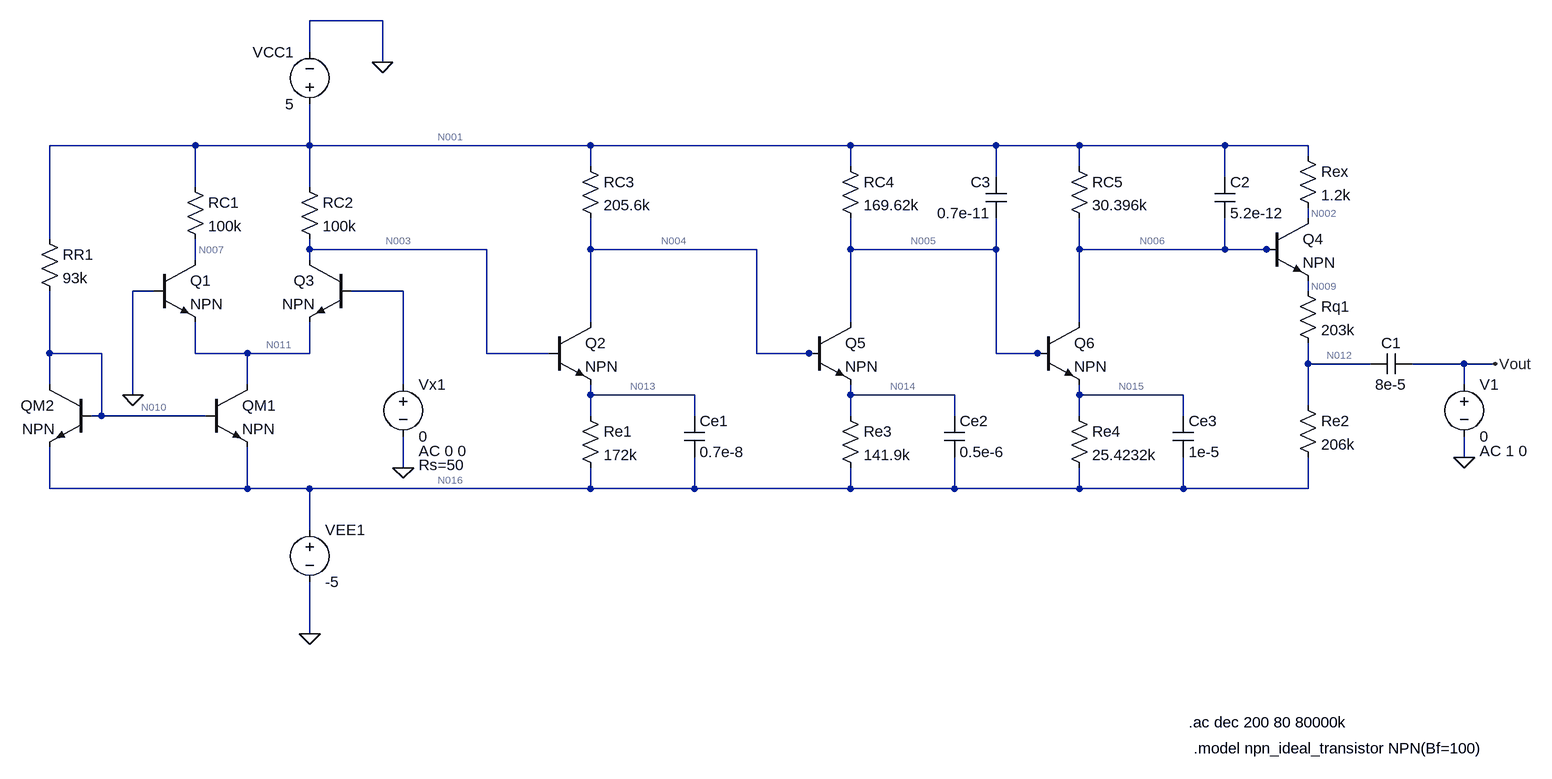
[diagram p0: schematic Rout.asc]
Rout.asc, the LTspice schematic file:
Version 4
SHEET 1 1876 912
WIRE -336 -224 -448 -224
WIRE -448 -176 -448 -224
WIRE -336 -160 -336 -224
WIRE -624 -32 -848 -32
WIRE -448 -32 -448 -96
WIRE -448 -32 -624 -32
WIRE -16 -32 -448 -32
WIRE 384 -32 -16 -32
WIRE 608 -32 384 -32
WIRE 736 -32 608 -32
WIRE 960 -32 736 -32
WIRE 1088 -32 960 -32
WIRE 1088 -16 1088 -32
WIRE -16 0 -16 -32
WIRE 384 0 384 -32
WIRE 736 0 736 -32
WIRE 608 16 608 -32
WIRE 960 16 960 -32
WIRE -624 32 -624 -32
WIRE -448 32 -448 -32
WIRE 1088 80 1088 64
WIRE -848 112 -848 -32
WIRE -448 128 -448 112
WIRE -176 128 -448 128
WIRE -16 128 -16 80
WIRE 240 128 -16 128
WIRE 384 128 384 80
WIRE 608 128 608 80
WIRE 608 128 384 128
WIRE 736 128 736 80
WIRE 960 128 960 80
WIRE 960 128 736 128
WIRE 1024 128 960 128
WIRE 1040 128 1024 128
WIRE -624 144 -624 112
WIRE -448 144 -448 128
WIRE -688 192 -720 192
WIRE -304 192 -384 192
WIRE 1088 192 1088 176
WIRE -16 240 -16 128
WIRE 384 240 384 128
WIRE 736 240 736 128
WIRE -848 288 -848 192
WIRE -768 288 -848 288
WIRE -624 288 -624 240
WIRE -544 288 -624 288
WIRE -448 288 -448 240
WIRE -448 288 -544 288
WIRE -176 288 -176 128
WIRE -80 288 -176 288
WIRE 240 288 240 128
WIRE 320 288 240 288
WIRE 336 288 320 288
WIRE 608 288 608 128
WIRE 672 288 608 288
WIRE 688 288 672 288
WIRE 1088 304 1088 272
WIRE 1184 304 1088 304
WIRE 1328 304 1248 304
WIRE 1376 304 1328 304
WIRE -848 336 -848 288
WIRE -544 336 -544 288
WIRE -304 336 -304 192
WIRE 1328 336 1328 304
WIRE -720 352 -720 192
WIRE -16 352 -16 336
WIRE 144 352 -16 352
WIRE 384 352 384 336
WIRE 544 352 384 352
WIRE 736 352 736 336
WIRE 896 352 736 352
WIRE 1088 368 1088 304
WIRE -768 384 -768 288
WIRE -768 384 -784 384
WIRE -608 384 -768 384
WIRE -16 384 -16 352
WIRE 144 384 144 352
WIRE 384 384 384 352
WIRE 544 384 544 352
WIRE 736 384 736 352
WIRE 896 384 896 352
WIRE 1328 448 1328 416
WIRE -304 464 -304 416
WIRE -848 496 -848 432
WIRE -544 496 -544 432
WIRE -544 496 -848 496
WIRE -448 496 -544 496
WIRE -16 496 -16 464
WIRE -16 496 -448 496
WIRE 144 496 144 448
WIRE 144 496 -16 496
WIRE 384 496 384 464
WIRE 384 496 144 496
WIRE 544 496 544 448
WIRE 544 496 384 496
WIRE 736 496 736 464
WIRE 736 496 544 496
WIRE 896 496 896 448
WIRE 896 496 736 496
WIRE 1088 496 1088 448
WIRE 1088 496 896 496
WIRE -448 560 -448 496
WIRE -448 720 -448 640
FLAG -448 720 0
FLAG -336 -160 0
FLAG -304 464 0
FLAG 1328 448 0
FLAG 1376 304 Vout
FLAG -720 352 0
SYMBOL res -640 16 R0
SYMATTR InstName RC1
SYMATTR Value 100k
SYMBOL res -464 16 R0
SYMATTR InstName RC2
SYMATTR Value 100k
SYMBOL Res -32 368 R0
SYMATTR InstName Re1
SYMATTR Value 172k
SYMBOL Res -864 96 R0
SYMATTR InstName RR1
SYMATTR Value 93k
SYMBOL Res -32 -16 R0
SYMATTR InstName RC3
SYMATTR Value 205.6k
SYMBOL npn -688 144 R0
SYMATTR InstName Q1
SYMBOL npn -80 240 R0
SYMATTR InstName Q2
SYMBOL npn -608 336 R0
SYMATTR InstName QM1
SYMBOL npn -784 336 M0
SYMATTR InstName QM2
SYMBOL npn -384 144 M0
SYMATTR InstName Q3
SYMBOL voltage -448 544 R0
SYMATTR InstName VEE1
SYMATTR Value -5
SYMBOL voltage -448 -80 R180
WINDOW 0 24 96 Left 2
WINDOW 3 24 16 Left 2
SYMATTR InstName VCC1
SYMATTR Value 5
SYMBOL voltage -304 320 R0
WINDOW 123 24 118 Left 2
WINDOW 39 24 140 Left 2
SYMATTR Value2 AC 0 0
SYMATTR SpiceLine Rs=50
SYMATTR InstName Vx1
SYMATTR Value 0
SYMBOL cap 128 384 R0
SYMATTR InstName Ce1
SYMATTR Value 0.7e-8
SYMBOL npn 1024 80 R0
SYMATTR InstName Q4
SYMBOL Res 1072 352 R0
SYMATTR InstName Re2
SYMATTR Value 206k
SYMBOL cap 1248 288 R90
WINDOW 0 0 32 VBottom 2
WINDOW 3 32 32 VTop 2
SYMATTR InstName C1
SYMATTR Value 8e-5
SYMBOL Res 368 368 R0
SYMATTR InstName Re3
SYMATTR Value 141.9k
SYMBOL Res 368 -16 R0
SYMATTR InstName RC4
SYMATTR Value 169.62k
SYMBOL npn 320 240 R0
SYMATTR InstName Q5
SYMBOL cap 528 384 R0
SYMATTR InstName Ce2
SYMATTR Value 0.5e-6
SYMBOL Res 1072 176 R0
SYMATTR InstName Rq1
SYMATTR Value 203k
SYMBOL Res 720 368 R0
SYMATTR InstName Re4
SYMATTR Value 25.4232k
SYMBOL Res 720 -16 R0
SYMATTR InstName RC5
SYMATTR Value 30.396k
SYMBOL npn 672 240 R0
SYMATTR InstName Q6
SYMBOL cap 880 384 R0
SYMATTR InstName Ce3
SYMATTR Value 1e-5
SYMBOL cap 944 16 R0
SYMATTR InstName C2
SYMATTR Value 5.2e-12
SYMBOL cap 624 80 R180
WINDOW 0 24 56 Left 2
WINDOW 3 24 8 Left 2
SYMATTR InstName C3
SYMATTR Value 0.7e-11
SYMBOL Voltage 1328 320 R0
WINDOW 123 24 118 Left 2
SYMATTR Value2 AC 1 0
SYMATTR InstName V1
SYMATTR Value 0
SYMBOL Res 1072 -32 R0
SYMATTR InstName Rex
SYMATTR Value 1.2k
TEXT 904 856 Left 2 !.ac dec 200 80 80000k
TEXT 912 896 Left 2 !.model npn_ideal_transistor NPN(Bf=100)

The netlist it stands for:
* Rout.asc
RC1 N001 N007 100k
RC2 N001 N003 100k
Re1 N013 N016 172k
RR1 N001 N010 93k
RC3 N001 N004 205.6k
Q1 N007 0 N011 0 NPN
Q2 N004 N003 N013 0 NPN
QM1 N011 N010 N016 0 NPN
QM2 N010 N010 N016 0 NPN
Q3 N003 N008 N011 0 NPN
VEE1 N016 0 -5
VCC1 N001 0 5
Vx1 N008 0 0 AC 0 0 Rs=50
Ce1 N013 N016 0.7e-8
Q4 N002 N006 N009 0 NPN
Re2 N012 N016 206k
C1 Vout N012 8e-5
Re3 N014 N016 141.9k
RC4 N001 N005 169.62k
Q5 N005 N004 N014 0 NPN
Ce2 N014 N016 0.5e-6
Rq1 N009 N012 203k
Re4 N015 N016 25.4232k
RC5 N001 N006 30.396k
Q6 N006 N005 N015 0 NPN
Ce3 N015 N016 1e-5
C2 N001 N006 5.2e-12
C3 N005 N001 0.7e-11
V1 Vout 0 0 AC 1 0
Rex N001 N002 1.2k
.model NPN NPN
.model PNP PNP
.lib standard.bjt
.ac dec 200 80 80000k
.model npn_ideal_transistor NPN(Bf=100)
.backanno
.end

* Results of the author's LTspice run, read from the files saved beside the schematic
* Operating Point, zero values left out:
*   V(n001) = 5 V
*   V(n007) = 153.9 mV
*   V(n003) = 128 mV
*   V(n013) = -551.5 mV
*   V(n016) = -5 V
*   V(n010) = -4.286 V
*   V(n004) = -321.5 mV
*   V(n011) = -695.9 mV
*   V(n002) = 4.988 V
*   V(n006) = -46.55 mV
*   V(n009) = -702.7 mV
*   V(n012) = -2.836 V
*   V(n014) = -1.003 V
*   V(n005) = -11.76 mV
*   V(n015) = -739.5 mV
*   Ic(Q6) = 165.9 µA
*   Ib(Q6) = 1.659 µA
*   Ie(Q6) = -167.6 µA
*   Ic(Q5) = 27.89 µA
*   Ib(Q5) = 278.9 nA
*   Ie(Q5) = -28.17 µA
*   Ic(Q4) = 10.4 µA
*   Ib(Q4) = 104 nA
*   Ie(Q4) = -10.51 µA
*   Ic(Q3) = 48.46 µA
*   Ib(Q3) = 484.6 nA
*   Ie(Q3) = -48.95 µA
*   Ic(Qm2) = 97.89 µA
*   Ib(Qm2) = 978.9 nA
*   Ie(Qm2) = -98.87 µA
*   Ic(Qm1) = 97.89 µA
*   Ib(Qm1) = 978.9 nA
*   Ie(Qm1) = -98.87 µA
*   Ic(Q2) = 25.6 µA
*   Ib(Q2) = 259.6 nA
*   Ie(Q2) = -25.86 µA
*   Ic(Q1) = 48.46 µA
*   Ib(Q1) = 484.6 nA
*   Ie(Q1) = -48.95 µA
*   I(Rex) = 10.4 µA
*   I(Rc5) = 166 µA
*   I(Re4) = 167.6 µA
*   I(Rq1) = 10.51 µA
*   I(Rc4) = 29.55 µA
*   I(Re3) = 28.17 µA
*   I(Re2) = 10.51 µA
*   I(Rc3) = 25.88 µA
*   I(Rr1) = 99.85 µA
*   I(Re1) = 25.86 µA
*   I(Rc2) = 48.72 µA
*   I(Rc1) = 48.46 µA
*   I(Vx1) = -484.6 nA
*   I(Vcc1) = -428.9 µA
*   I(Vee1) = 429.9 µA
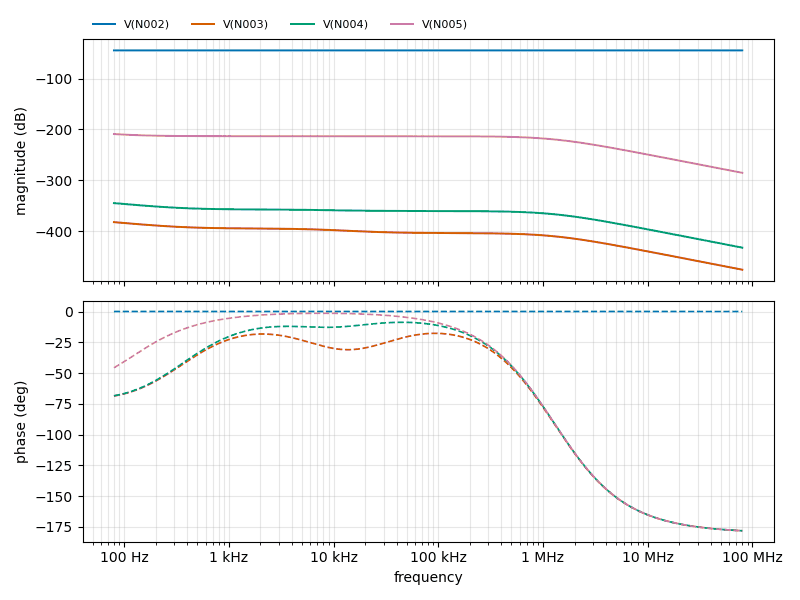
[diagram p1: AC Analysis of Rout.asc, plotted from the saved traces]
* AC Analysis, 1 run:
*   V(N002): -44.77 dB at 80 Hz, -44.76 dB at 80 MHz, peak -44.76 dB at 80 MHz
*   V(N003): -382.43 dB at 80 Hz, -475.94 dB at 80 MHz, peak -382.43 dB at 80 Hz, 3 dB below the peak at 118.7 Hz
*   V(N004): -345.04 dB at 80 Hz, -432.59 dB at 80 MHz, peak -345.04 dB at 80 Hz, 3 dB below the peak at 118.7 Hz
*   V(N005): -209.25 dB at 80 Hz, -285.49 dB at 80 MHz, peak -209.25 dB at 80 Hz, 3 dB below the peak at 181.5 Hz